# EAGLE design Callisto_Teknic_MSO_PBx4_v1p1 (EAGLE 9.6.2)
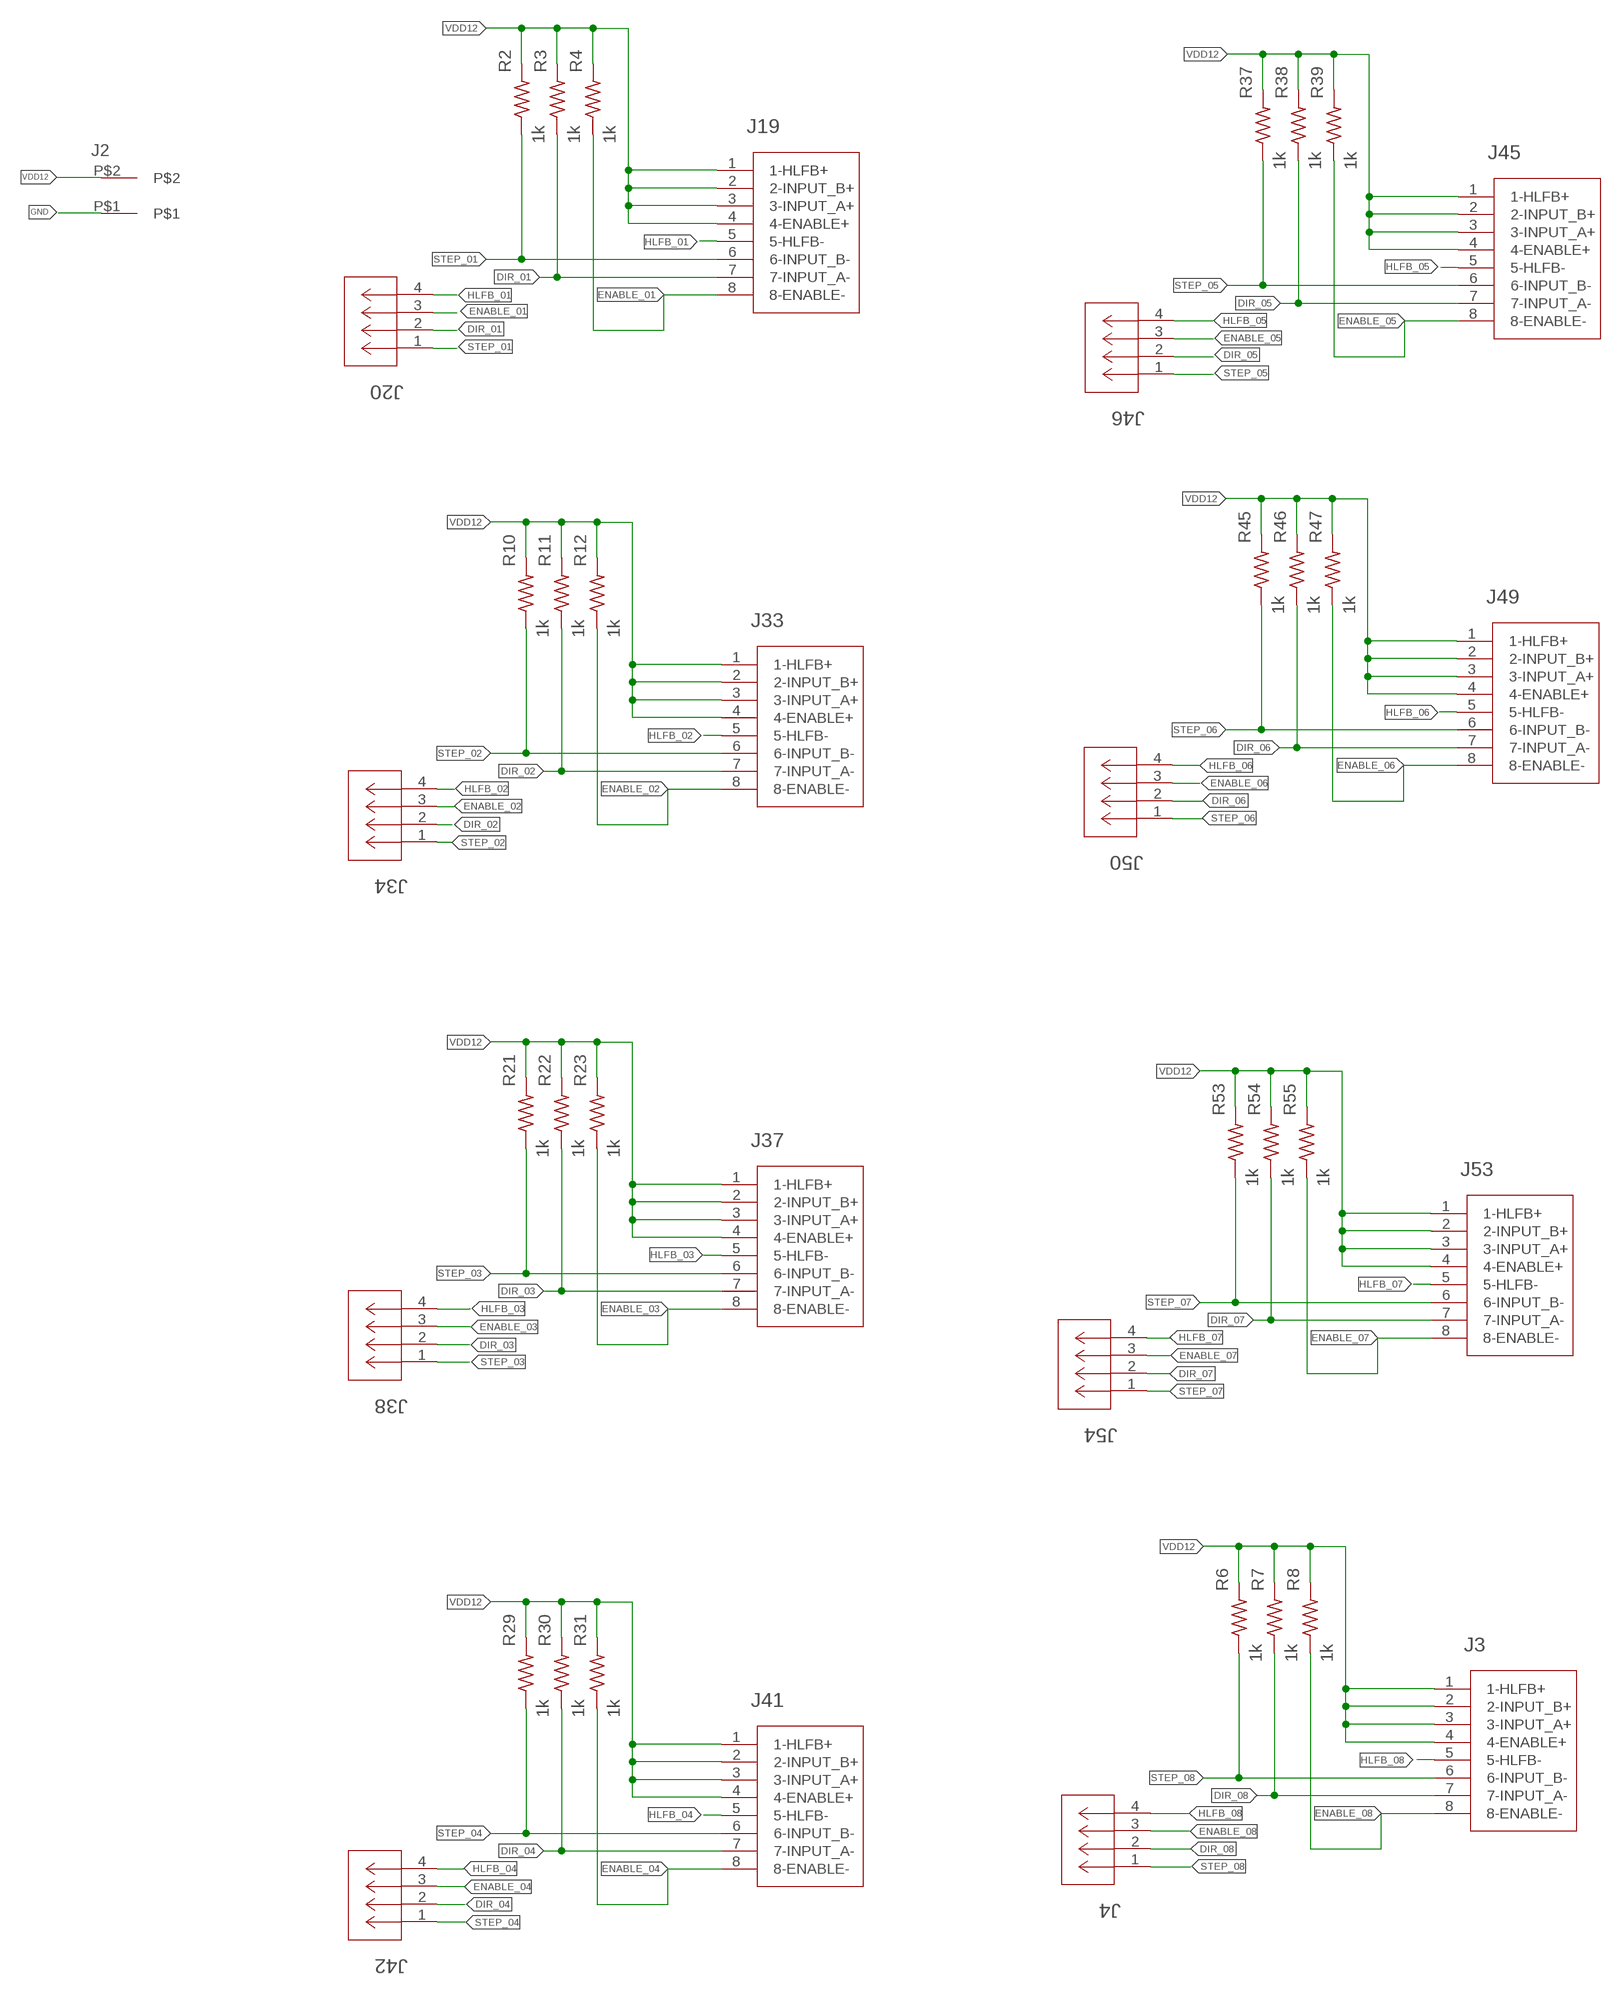
[diagram p0: schematic, sheet 1]

## Parts
J2  2-pos  3.81MM_1_X_2_RT_ANGLE_PLUG_HEADER  [2_3.81MM_PITCH]
J3  TEKNIC_8PIN_MOTOR  [CON_39281083]
J4  CONN_530470410_PICOBLADE_X_4  [CON_530470410_MOL]
J19  TEKNIC_8PIN_MOTOR  [CON_39281083]
J20  CONN_530470410_PICOBLADE_X_4  [CON_530470410_MOL]
J33  TEKNIC_8PIN_MOTOR  [CON_39281083]
J34  CONN_530470410_PICOBLADE_X_4  [CON_530470410_MOL]
J37  TEKNIC_8PIN_MOTOR  [CON_39281083]
J38  CONN_530470410_PICOBLADE_X_4  [CON_530470410_MOL]
J41  TEKNIC_8PIN_MOTOR  [CON_39281083]
J42  CONN_530470410_PICOBLADE_X_4  [CON_530470410_MOL]
J45  TEKNIC_8PIN_MOTOR  [CON_39281083]
J46  CONN_530470410_PICOBLADE_X_4  [CON_530470410_MOL]
J49  TEKNIC_8PIN_MOTOR  [CON_39281083]
J50  CONN_530470410_PICOBLADE_X_4  [CON_530470410_MOL]
J53  TEKNIC_8PIN_MOTOR  [CON_39281083]
J54  CONN_530470410_PICOBLADE_X_4  [CON_530470410_MOL]
R2  1k  R_0805  [0805]
R3  1k  R_0805  [0805]
R4  1k  R_0805  [0805]
R6  1k  R_0805  [0805]
R7  1k  R_0805  [0805]
R8  1k  R_0805  [0805]
R10  1k  R_0805  [0805]
R11  1k  R_0805  [0805]
R12  1k  R_0805  [0805]
R21  1k  R_0805  [0805]
R22  1k  R_0805  [0805]
R23  1k  R_0805  [0805]
R29  1k  R_0805  [0805]
R30  1k  R_0805  [0805]
R31  1k  R_0805  [0805]
R37  1k  R_0805  [0805]
R38  1k  R_0805  [0805]
R39  1k  R_0805  [0805]
R45  1k  R_0805  [0805]
R46  1k  R_0805  [0805]
R47  1k  R_0805  [0805]
R53  1k  R_0805  [0805]
R54  1k  R_0805  [0805]
R55  1k  R_0805  [0805]

## Nets
DIR_01: J19.7(7-INPUT_A-) J20.2 R3.1
DIR_02: J33.7(7-INPUT_A-) J34.2 R11.1
DIR_03: J37.7(7-INPUT_A-) J38.2 R22.1
DIR_04: J41.7(7-INPUT_A-) J42.2 R30.1
DIR_05: J45.7(7-INPUT_A-) J46.2 R38.1
DIR_06: J49.7(7-INPUT_A-) J50.2 R46.1
DIR_07: J53.7(7-INPUT_A-) J54.2 R54.1
DIR_08: J3.7(7-INPUT_A-) J4.2 R7.1
ENABLE_01: J19.8(8-ENABLE-) J20.3 R4.1
ENABLE_02: J33.8(8-ENABLE-) J34.3 R12.1
ENABLE_03: J37.8(8-ENABLE-) J38.3 R23.1
ENABLE_04: J41.8(8-ENABLE-) J42.3 R31.1
ENABLE_05: J45.8(8-ENABLE-) J46.3 R39.1
ENABLE_06: J49.8(8-ENABLE-) J50.3 R47.1
ENABLE_07: J53.8(8-ENABLE-) J54.3 R55.1
ENABLE_08: J3.8(8-ENABLE-) J4.3 R8.1
GND: J2.P$1
HLFB_01: J19.5(5-HLFB-) J20.4
HLFB_02: J33.5(5-HLFB-) J34.4
HLFB_03: J37.5(5-HLFB-) J38.4
HLFB_04: J41.5(5-HLFB-) J42.4
HLFB_05: J45.5(5-HLFB-) J46.4
HLFB_06: J49.5(5-HLFB-) J50.4
HLFB_07: J53.5(5-HLFB-) J54.4
HLFB_08: J3.5(5-HLFB-) J4.4
STEP_01: J19.6(6-INPUT_B-) J20.1 R2.1
STEP_02: J33.6(6-INPUT_B-) J34.1 R10.1
STEP_03: J37.6(6-INPUT_B-) J38.1 R21.1
STEP_04: J41.6(6-INPUT_B-) J42.1 R29.1
STEP_05: J45.6(6-INPUT_B-) J46.1 R37.1
STEP_06: J49.6(6-INPUT_B-) J50.1 R45.1
STEP_07: J53.6(6-INPUT_B-) J54.1 R53.1
STEP_08: J3.6(6-INPUT_B-) J4.1 R6.1
VDD12: J2.P$2 J3.1(1-HLFB+) J3.2(2-INPUT_B+) J3.3(3-INPUT_A+) J3.4(4-ENABLE+) J19.1(1-HLFB+) J19.2(2-INPUT_B+) J19.3(3-INPUT_A+) J19.4(4-ENABLE+) J33.1(1-HLFB+) J33.2(2-INPUT_B+) J33.3(3-INPUT_A+) J33.4(4-ENABLE+) J37.1(1-HLFB+) J37.2(2-INPUT_B+) J37.3(3-INPUT_A+) J37.4(4-ENABLE+) J41.1(1-HLFB+) J41.2(2-INPUT_B+) J41.3(3-INPUT_A+) J41.4(4-ENABLE+) J45.1(1-HLFB+) J45.2(2-INPUT_B+) J45.3(3-INPUT_A+) J45.4(4-ENABLE+) J49.1(1-HLFB+) J49.2(2-INPUT_B+) J49.3(3-INPUT_A+) J49.4(4-ENABLE+) J53.1(1-HLFB+) J53.2(2-INPUT_B+) J53.3(3-INPUT_A+) J53.4(4-ENABLE+) R2.2 R3.2 R4.2 R6.2 R7.2 R8.2 R10.2 R11.2 R12.2 R21.2 R22.2 R23.2 R29.2 R30.2 R31.2 R37.2 R38.2 R39.2 R45.2 R46.2 R47.2 R53.2 R54.2 R55.2

## Library data of the parts
J2 = 3D_MIG_Controller:3.81MM_1_X_2_RT_ANGLE_PLUG_HEADER: TERM BLOCK HDR 2POS 90DEG 3.81MM; PARTNO: 691322310002
J3 J19 J33 J37 J41 J45 J49 J53 = 3D_MIG_Controller:TEKNIC_8PIN_MOTOR; COPYRIGHT: Copyright (C) 2022 Ultra Librarian. All rights reserved.; MANUFACTURER_PART_NUMBER: 39281083; MFR_NAME: Molex Connector Corporation
J4 J20 J34 J38 J42 J46 J50 J54 = 3D_MIG_Controller:CONN_530470410_PICOBLADE_X_4; COPYRIGHT: Copyright (C) 2022 Ultra Librarian. All rights reserved.; MANUFACTURER_PART_NUMBER: 530470410; MFR_NAME: Molex Connector Corporation
R2-R4 R6-R8 R10-R12 R21-R23 R29-R31 R37-R39 R45-R47 R53-R55 = 3D_MIG_Controller:R_0805

## Board
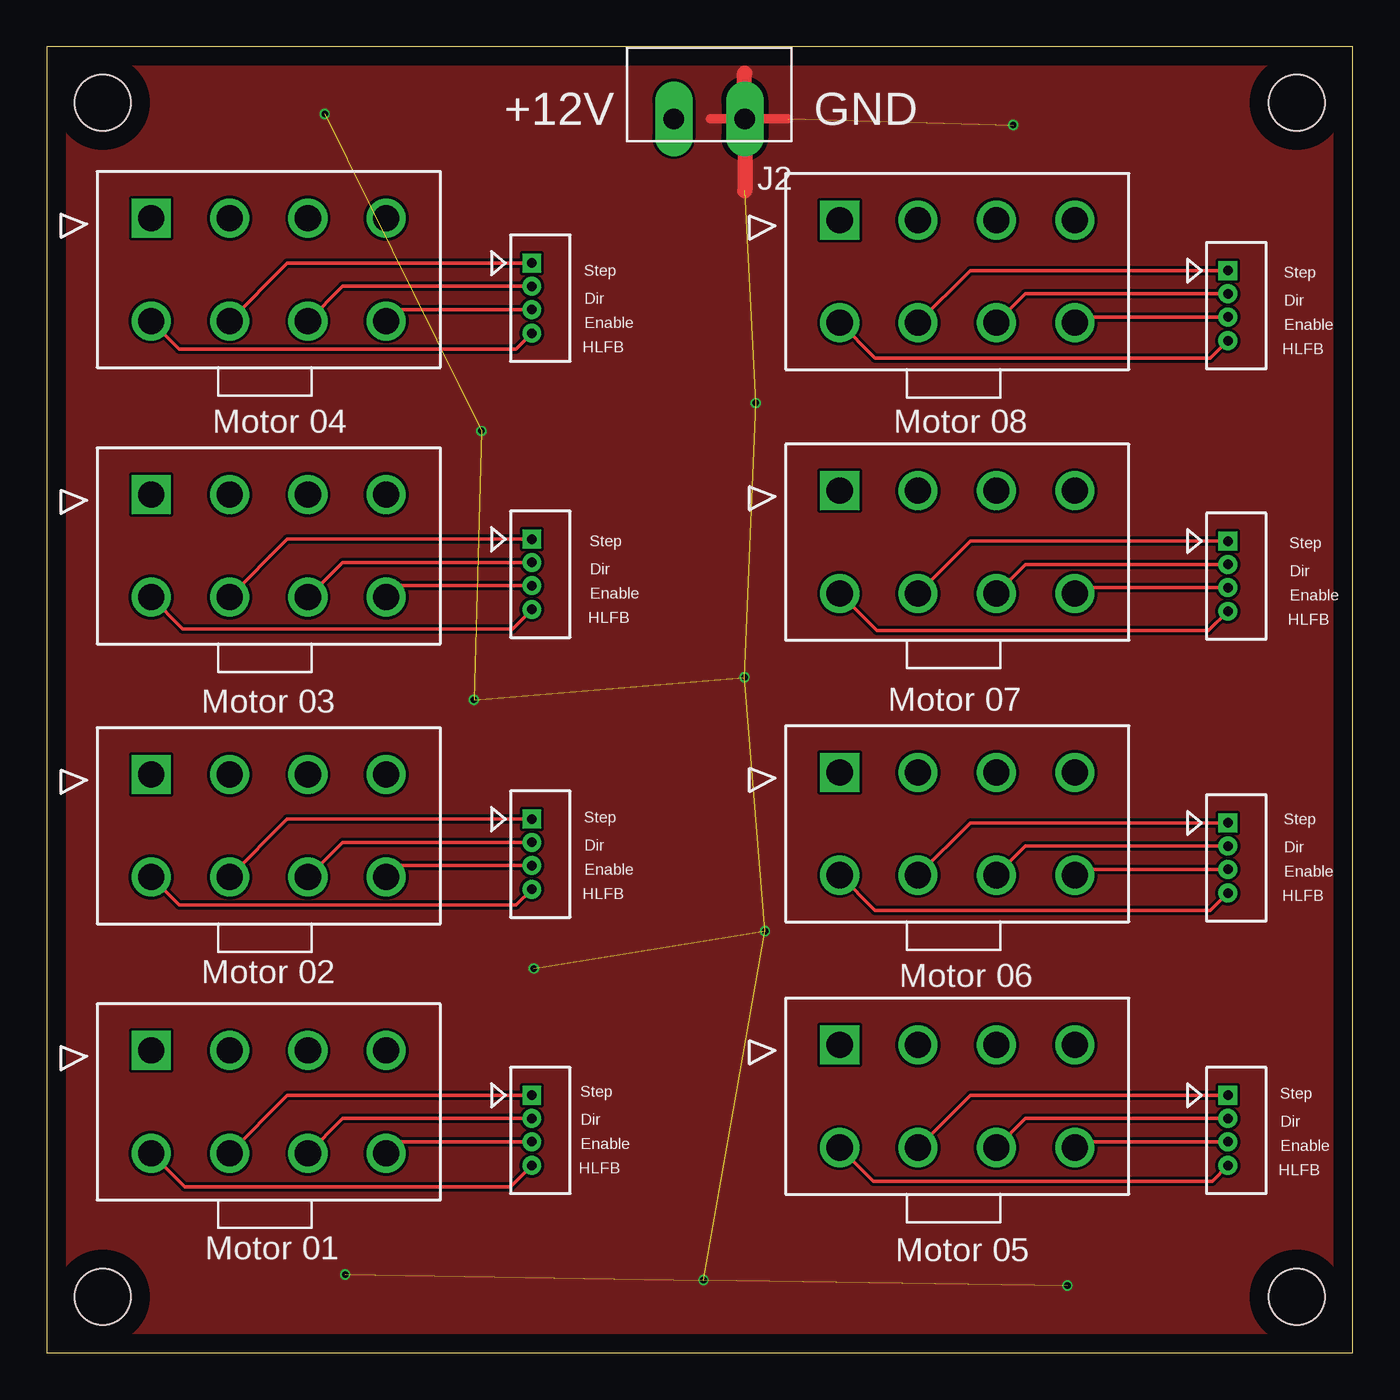
[diagram p1: board, top side]
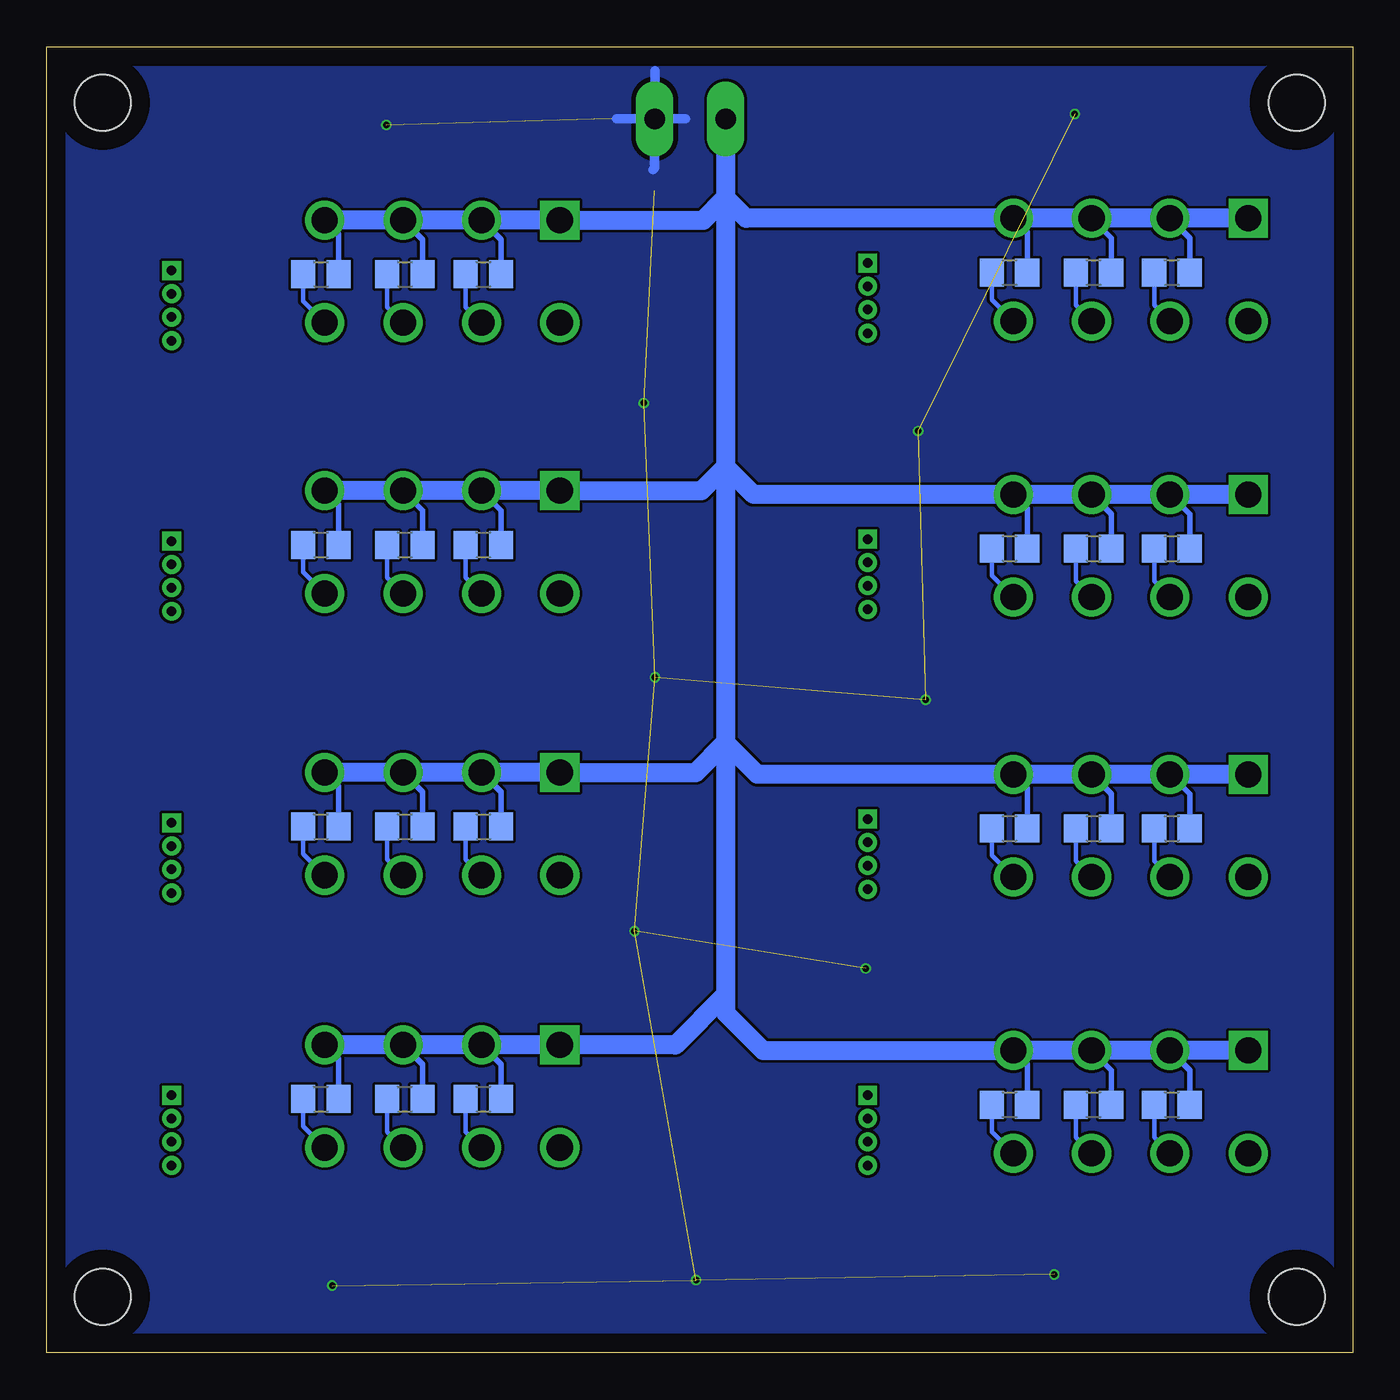
[diagram p2: board, bottom side, seen from below]

Size 70 x 70 mm. Coordinates in mm from the lower left corner, seen from the top.
Outline: 0,0 70,0 70,70 0,70 0,0
Copper layers (1*16): Top 0.035mm / dielectric 1.5mm / Bottom 0.035mm
Design rules "default": minimum track width 6mil, minimum drill 0.2mm, track to track 6mil, track to pad 6mil, pad to pad 6mil, via to via 6mil, smd to smd 6mil, copper to edge 40mil, drill to drill 6mil, minimum pad ring 10mil, minimum via ring 4mil, stop-mask expansion 4mil, vias tented up to drill 0mil, thermal gap 10mil
Holes 3 mm at 3,3 67,3 67,67 3,67

### Footprints (pad centres in the part's own frame; a part is rotated, then mirrored left to right if it is on the bottom)
2_3.81MM_PITCH = drill 1.1 pad 2 long: P$1 0,0; P$2 3.81,0
CON_39281083 = drill 1.397 pad 1.905 square: 1 12.6,-5.5 | drill 1.397 pad 1.905: 2 8.4,-5.5; 3 4.2,-5.5; 4 0,-5.5; 5 12.6,0; 6 8.4,0; 7 4.2,0; 8 0,0
CON_530470410_MOL = drill 0.508 pad 0.838 square: 1 0,0 | drill 0.508 pad 0.838: 2 -1.245,0; 3 -2.489,0; 4 -3.759,0
0805 = smd 1.3 x 1.5: 1 -0.95,0; 2 0.95,0

### Placement (x,y rotation side)
J2  37.42,66.13 180 top
J3  55.1,55.2 180 top
J4  63.3,58 90 top
J19  18.2,10.7 180 top
J20  26,13.8 90 top
J33  18.2,25.5 180 top
J34  26,28.6 90 top
J37  18.2,40.5 180 top
J38  26,43.6 90 top
J41  18.2,55.3 180 top
J42  26,58.4 90 top
J45  55.1,11 180 top
J46  63.3,13.8 90 top
J49  55.1,25.6 180 top
J50  63.3,28.4 90 top
J53  55.1,40.7 180 top
J54  63.3,43.5 90 top
R2  9.7,13.3 0 bottom
R3  13.9,13.3 0 bottom
R4  18.4,13.3 0 bottom
R6  46.6,57.8 0 bottom
R7  50.8,57.8 0 bottom
R8  55.3,57.8 0 bottom
R10  9.7,28.1 0 bottom
R11  13.9,28.1 0 bottom
R12  18.4,28.1 0 bottom
R21  9.7,43.1 0 bottom
R22  13.9,43.1 0 bottom
R23  18.4,43.1 0 bottom
R29  9.7,57.9 0 bottom
R30  13.9,57.9 0 bottom
R31  18.4,57.9 0 bottom
R37  46.6,13.6 0 bottom
R38  50.8,13.6 0 bottom
R39  55.3,13.6 0 bottom
R45  46.6,28.2 0 bottom
R46  50.8,28.2 0 bottom
R47  55.3,28.2 0 bottom
R53  46.6,43.3 0 bottom
R54  50.8,43.3 0 bottom
R55  55.3,43.3 0 bottom

### Tracks (layer width: path | path; a pad name or v marks a point on that pad's centre or on a via)
DIR_01
  Top 0.2: J19.7 15.86,12.55 J20.2
  Bottom 0.254: R3.1 14.85,11.55 J19.7
DIR_02
  Top 0.2: J33.7 15.86,27.36 J34.2
  Bottom 0.254: R11.1 14.85,26.35 J33.7
DIR_03
  Top 0.2: J37.7 15.86,42.35 J38.2
  Bottom 0.254: R22.1 14.85,41.35 J37.7
DIR_04
  Top 0.2: J41.7 15.86,57.16 J42.2
  Bottom 0.254: R30.1 14.85,56.15 J41.7
DIR_05
  Top 0.2: J45.7 52.45,12.55 J46.2
  Bottom 0.254: R38.1 51.75,11.85 J45.7
DIR_06
  Top 0.2: J50.2 52.45,27.16 J49.7
  Bottom 0.254: R46.1 51.75,26.45 J49.7
DIR_07
  Top 0.2: J53.7 52.45,42.26 J54.2
  Bottom 0.254: R54.1 51.75,41.55 J53.7
DIR_08
  Top 0.2: J3.7 52.45,56.76 J4.2
  Bottom 0.254: R7.1 51.75,56.05 J3.7
ENABLE_01
  Top 0.2: J19.8 18.81,11.31 J20.3
  Bottom 0.254: R4.1 19.35,11.85 J19.8
ENABLE_02
  Top 0.2: J33.8 18.81,26.11 J34.3
  Bottom 0.254: R12.1 19.35,26.65 J33.8
ENABLE_03
  Top 0.2: J37.8 18.81,41.11 J38.3
  Bottom 0.254: R23.1 19.35,41.65 J37.8
ENABLE_04
  Top 0.2: J41.8 18.81,55.91 J42.3
  Bottom 0.254: R31.1 19.35,56.45 J41.8
ENABLE_05
  Top 0.2: J45.8 55.41,11.31 J46.3
  Bottom 0.254: R39.1 56.25,12.15 J45.8
ENABLE_06
  Top 0.2: J49.8 55.41,25.91 J50.3
  Bottom 0.254: R47.1 56.25,26.75 J49.8
ENABLE_07
  Top 0.2: J53.8 55.41,41.01 J54.3
  Bottom 0.254: R55.1 56.25,41.85 J53.8
ENABLE_08
  Top 0.2: J3.8 55.41,55.51 J4.3
  Bottom 0.254: R8.1 56.25,56.35 J3.8
GND  (via drill 0.35)  (11 unrouted)
  Top 0.508: 39.73,66.13 J2.P$1 35.57,66.13
  Top 0.813: 37.42,62.28 J2.P$1 37.4,66.15 37.4,68.58
  Bottom 0.508: J2.P$1 39.47,66.13 | J2.P$1 35.77,66.13 | J2.P$1 37.42,63.48 37.5,63.4 | J2.P$1 37.4,66.15 37.4,68.7
  other vias: 16,4.2 35.2,3.9 54.7,3.6 26.1,20.6 38.5,22.6 22.9,35 37.4,36.2 23.3,49.4 38,50.9 14.9,66.4 51.8,65.8
  pour Bottom: 0,70 70,70 70,0 0,0
  pour Top: 0,70.1 70,70.1 70,0 0,0
HLFB_01
  Top 0.2: J19.5 7.4,8.9 24.86,8.9 J20.4
HLFB_02
  Top 0.2: J33.5 7.1,24 25.16,24 J34.4
HLFB_03
  Top 0.2: J37.5 7.3,38.8 24.96,38.8 J38.4
HLFB_04
  Top 0.2: J41.5 7.1,53.8 25.16,53.8 J42.4
HLFB_05
  Top 0.2: J45.5 44.3,9.2 62.46,9.2 J46.4
HLFB_06
  Top 0.2: J49.5 44.4,23.7 62.36,23.7 J50.4
HLFB_07
  Top 0.2: J53.5 44.5,38.7 62.26,38.7 J54.4
HLFB_08
  Top 0.2: J3.5 44.4,53.3 62.36,53.3 J4.4
STEP_01
  Top 0.2: J19.6 12.9,13.8 J20.1
  Bottom 0.254: R2.1 10.65,11.55 J19.6
STEP_02
  Top 0.2: J33.6 12.9,28.6 J34.1
  Bottom 0.254: R10.1 10.65,26.35 J33.6
STEP_03
  Top 0.2: J37.6 12.9,43.6 J38.1
  Bottom 0.254: R21.1 10.65,41.35 J37.6
STEP_04
  Top 0.2: J41.6 12.9,58.4 J42.1
  Bottom 0.254: R29.1 10.65,56.15 J41.6
STEP_05
  Top 0.2: J45.6 49.5,13.8 J46.1
  Bottom 0.2: 46.7,10.9 J45.6
  Bottom 0.254: R37.1 47.55,11.85 J45.6
STEP_06
  Top 0.2: J49.6 49.5,28.4 J50.1
  Bottom 0.254: R45.1 47.55,26.45 J49.6
STEP_07
  Top 0.2: J53.6 49.5,43.5 J54.1
  Bottom 0.254: R53.1 47.55,41.55 J53.6
STEP_08
  Top 0.2: J4.1 49.5,58 J3.6
  Bottom 0.254: R6.1 47.55,56.05 J3.6
VDD12
  Bottom 0.305: R2.2 8.75,15.15 J19.2 | R3.2 12.95,15.15 J19.3 | R4.2 17.45,15.45 J19.4 | R10.2 8.75,29.95 J33.2 | R11.2 12.95,29.95 J33.3 | R12.2 17.45,30.25 J33.4 | R21.2 8.75,44.95 J37.2 | R22.2 12.95,44.95 J37.3 | R23.2 17.45,45.25 J37.4 | R29.2 8.75,59.75 J41.2 | R30.2 12.95,59.75 J41.3 | R31.2 17.45,60.05 J41.4 | R37.2 45.65,15.45 J45.2 | R38.2 49.85,15.45 J45.3 | R39.2 54.35,15.75 J45.4 | R45.2 45.65,30.05 J49.2 | R46.2 49.85,30.05 J49.3 | R47.2 54.35,30.35 J49.4 | R53.2 45.65,45.15 J53.2 | R54.2 49.85,45.15 J53.3 | R55.2 54.35,45.45 J53.4 | R6.2 45.65,59.65 J3.2 | R7.2 49.85,59.65 J3.3 | R8.2 54.35,59.95 J3.4
  Bottom 1.016: J19.1 J19.2 J19.3 J19.4 31.6,16.2 33.61,18.21 33.61,19.2 | J33.1 J33.2 J33.3 J33.4 31.91,31 33.61,32.7 | J37.1 J37.2 J37.3 J37.4 32.11,46 33.61,47.5 | J41.1 J41.2 J41.3 J41.4 32.51,60.8 33.61,61.9 | J45.4 J45.3 J45.2 J45.1 36.31,16.5 33.61,19.2 | J49.4 J49.3 J49.2 J49.1 35.21,31.1 33.61,32.7 | J53.4 J53.3 J53.2 J53.1 34.91,46.2 33.61,47.5 | J2.P$2 33.61,61.9 | 33.61,61.9 33.61,47.5 | 33.61,47.5 33.61,32.7 | 33.61,32.7 33.61,19.2 | J3.4 J3.3 J3.2 J3.1 34.81,60.7 33.61,61.9

### Text on the board
tPlace: +12V | GND | Step | Step | Dir | Dir | Enable | Enable | HLFB | HLFB | Motor 04 | Motor 08 | Step | Step | Dir | Dir | Enable | Enable | HLFB | HLFB | Motor 03 | Motor 07 | Step | Step | Dir | Dir | Enable | Enable | HLFB | HLFB | Motor 02 | Motor 06 | Step | Step | Dir | Dir | Enable | Enable | HLFB | HLFB | Motor 01 | Motor 05